# Altium schematic sheet Sheet1.SchDoc
size A; SheetNumber: 1; SheetTotal: 2
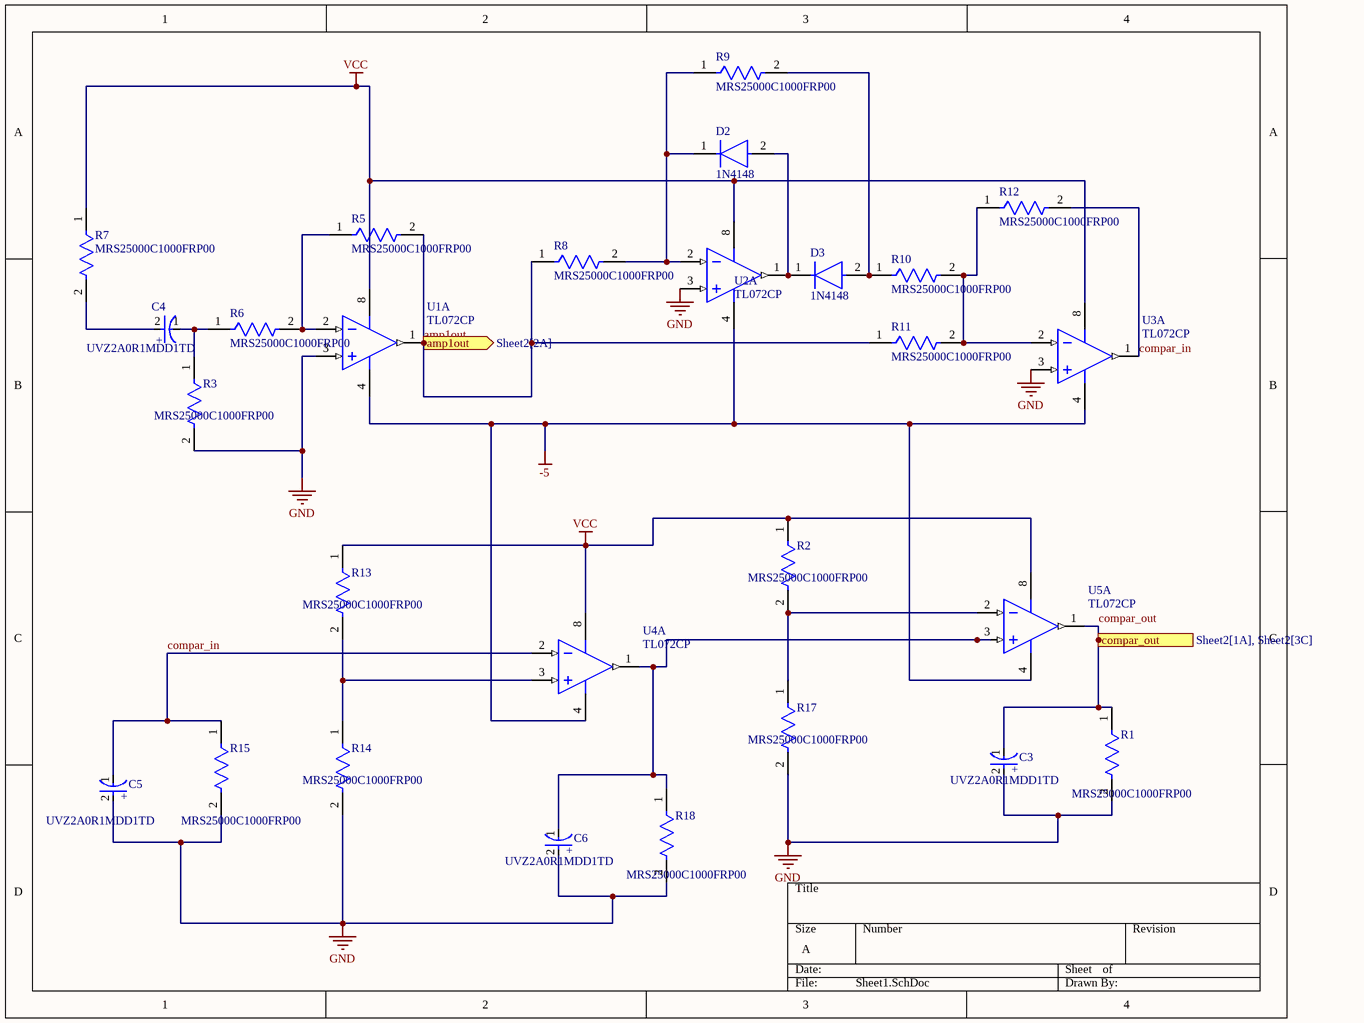
[diagram p0: Sheet1.SchDoc]

## Parts
C3  UVZ2A0R1MDD1TD  [FP-UVZ2A0R1MDD1TD-MFG]
C4  UVZ2A0R1MDD1TD  [FP-UVZ2A0R1MDD1TD-MFG]
C5  UVZ2A0R1MDD1TD  [FP-UVZ2A0R1MDD1TD-MFG]
C6  UVZ2A0R1MDD1TD  [FP-UVZ2A0R1MDD1TD-MFG]
D2  1N4148  [FP-017AG-MFG]
D3  1N4148  [FP-017AG-MFG]
R1  MRS25000C1000FRP00  [FP-MRS25-MFG]
R2  MRS25000C1000FRP00  [FP-MRS25-MFG]
R3  MRS25000C1000FRP00  [FP-MRS25-MFG]
R5  MRS25000C1000FRP00  [FP-MRS25-MFG]
R6  MRS25000C1000FRP00  [FP-MRS25-MFG]
R7  MRS25000C1000FRP00  [FP-MRS25-MFG]
R8  MRS25000C1000FRP00  [FP-MRS25-MFG]
R9  MRS25000C1000FRP00  [FP-MRS25-MFG]
R10  MRS25000C1000FRP00  [FP-MRS25-MFG]
R11  MRS25000C1000FRP00  [FP-MRS25-MFG]
R12  MRS25000C1000FRP00  [FP-MRS25-MFG]
R13  MRS25000C1000FRP00  [FP-MRS25-MFG]
R14  MRS25000C1000FRP00  [FP-MRS25-MFG]
R15  MRS25000C1000FRP00  [FP-MRS25-MFG]
R17  MRS25000C1000FRP00  [FP-MRS25-MFG]
R18  MRS25000C1000FRP00  [FP-MRS25-MFG]
U1  TL072CP  [P0008A]  (part A of 2)
U2  TL072CP  [P0008A]  (part A of 2)
U3  TL072CP  [P0008A]  (part A of 2)
U4  TL072CP  [P0008A]  (part A of 2)
U5  TL072CP  [P0008A]  (part A of 2)

## Ports
amp1out (out, see Sheet2[2A]), compar_out (out, see Sheet2[1A], Sheet2[3C])

## Nets
-5: U1.4(VCC-) U2.4(VCC-) U3.4(VCC-) U4.4(VCC-) U5.4(VCC-)
GND: C3.2(A) C5.2(A) C6.2(A) R1.2 R3.2 R14.2 R15.2 R17.2 R18.2 U1.3(IN1+) U2.3(IN1+) U3.3(IN1+)
VCC: R2.1 R7.1 R13.1 U1.8(VCC+) U2.8(VCC+) U3.8(VCC+) U4.8(VCC+) U5.8(VCC+)
amp1out: R5.2 R8.1 R11.1 U1.1(OUT1) ; port amp1out
compar_in: C5.1(C) R12.2 R15.1 U3.1(OUT1) U4.2(IN1-)
compar_out: C3.1(C) R1.1 U5.1(OUT1) ; port compar_out
NetC4_1: C4.1(C) R3.1 R6.1
NetC4_2: C4.2(A) R7.2
NetC6_1: C6.1(C) R18.1 U4.1(OUT1) U5.3(IN1+)
NetD2_1: D2.1(C) R8.2 R9.1 U2.2(IN1-)
NetD2_2: D2.2(A) D3.1(C) U2.1(OUT1)
NetD3_2: D3.2(A) R9.2 R10.1
NetR2_2: R2.2 R17.1 U5.2(IN1-)
NetR5_1: R5.1 R6.2 U1.2(IN1-)
NetR10_2: R10.2 R11.2 R12.1 U3.2(IN1-)
NetR13_2: R13.2 R14.1 U4.3(IN1+)

## Notes on the sheet
- (in symbol CMP-00267-12792183-1) +

## Library data of the parts
C3-C6 = CMP-00267-12792183-1: UVZ2A0R1MDD1TD Cap Alum 0.1UF 20% 100V Radial; Capacitance: 100nF; Leakage Current: 300nA; Ripple Current: 1.5mA; Dielectric Material: Aluminium; Life (Hours): 1000hours; Dissipation Factor: 8%; Voltage Rating: 100V; Height: 11mm; Tolerance: 20%; Mount: Through Hole; Case/Package: Radial; Voltage Rating (DC): 100V; NexarPartId: 12792183; Number of Pins: 2; Max Operating Temperature: 105°C; Height - Seated (Max): 12.4968mm; Diameter: 5mm; RoHS: Compliant; Lead Pitch: 2.0066mm; Min Operating Temperature: -55°C
D2 D3 = CMP-07163-000046-1: DIODE GEN PURP 100V 200MA DO35; Forward Voltage: 1V; Max Power Dissipation: 500mW; Max Reverse Current: 5uA; Forward Current: 300mA; Current: 4A; Reverse Recovery Time: 4ns; Element Configuration: Single; Outside Diameter: 1.85mm; Capacitance: 4pF; Polarity: Standard; Max Forward Surge Current (Ifsm): 1A; Reverse Voltage: 100V; Output Current: 200mA; Average Rectified Current: 200mA; Diameter: 1.91mm; Max Repetitive Reverse Voltage (Vrrm): 100V; Current Rating: 200mA; Case/Package: DO-35; Lead Free: Lead Free; Number of Pins: 2; Recovery Time: 4ns; Packaging: Bulk; Contact Plating: Tin; Voltage: 100V; Mount: Through Hole; Max Surge Current: 4A; Package Quantity: 2000; Width: 1.91mm; Max Reverse Voltage (DC): 100V; Length: 4.56mm; Radiation Hardening: No; Power Dissipation: 500mW; Voltage Rating (DC): 100V; Peak Non-Repetitive Surge Current: 4A; REACH SVHC: No SVHC; Height: 4.56mm; Max Operating Temperature: 175°C; Series: -; Weight: 0.01lb; Min Operating Temperature: -65°C
R1-R3 R5-R15 R17 R18 = CMP-00030-42757237-1: MRS25000C1000FRP00 Resistor, 100 Ohm, ± 1%, 600 mW, Axial Leaded, Metal Film (Thin Film), Professional; Max Power Dissipation: 600mW; Resistance: 100Ω; Voltage Rating: 350V; Temperature Coefficient: 50ppm/°C; Lead Diameter: 600µm; RoHS: Compliant; Radiation Hardening: No; Schedule B: 8533210090, 8533210090; Length: 6.5mm; Packaging: Tape & Reel (TR); Number of Terminations: 2; Mount: Through Hole; Width: 2.5mm; Tolerance: 1%; Military Standard: Not; Voltage Rating (DC): 350V; Contact Plating: Tin; Number of Pins: 2; Max Operating Temperature: 155°C; NexarPartId: 42757237; Diameter: 2.5mm; Composition: Metal Film, Thin Film; REACH SVHC: Unknown; Power Rating: 600mW; Lead Free: Lead Free; Termination: Axial; Case/Package: Axial; Min Operating Temperature: -55°C
U1-U5 = CMP-0017-00950-2: Dual Low-Noise JFET-Input General-Purpose Operational Amplifier, 7 to 36 V, 0 to 70 degC, 8-pin DIP (P8), Pb-Free (RoHS); Manufacturer: Texas Instruments; Sub Family: General Purpose Amplifier, High Supply Voltage Amplifier (>=30V); Total Supply Voltage(Max)(+5V is 5, +/-5V is 10): 36; Slew Rate(Typ)(V/us): 13; Vn at 1kHz(Typ)(nV/rtHz): 18; GBW(Typ)(MHz): 3; CMRR(Min)(dB): 70; Total Supply Voltage(Min)(+5V is 5, +/-5V is 10): 7; Vio (25C)(Max)(mV): 10; Rating: Catalog; IIB(Max)(pA): 200; Iq per channel(Max)(mA): 2.5; Number of Channels: 2; Mounting Technology: Through Hole; ComponentLink3Description: Package Specification; PartNumber: TL072CP; PackageVersion: 4040082/E, 04/2010; Eco-Plan: Pb-Free (RoHS); DatasheetVersion: SLOS080J; Offset Drift(Typ)(uV/C): 18; ComponentLink3URL: http://www.ti.com/litv/pdf/mpdi001b; PackageDescription: 8-Pin Plastic In-Line, Body 9.59 x 6.35 mm, Pitch 2.54 mm; Code_JEDEC: MS-001; ComponentLink2URL: http://www.ti.com/lit/ds/symlink/tl072.pdf; ComponentLink1Description: Manufacturer URL; ComponentLink2Description: Datasheet; ComponentLink1URL: http://www.ti.com/; PackageReference: P0008A